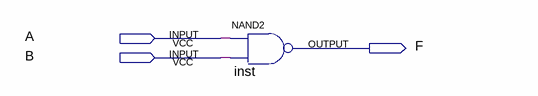
[diagram p0: schematic sheet]
// Quartus schematic Learn_VHDL.bdf as structural Verilog: 1 symbols, 3 pins
module Learn_VHDL (
  input  A,
  input  B,
  output F
);

  nand inst (F, A, B);
endmodule
